# Altium schematic sheet Top.SchDoc
size B; SheetNumber: 1; SheetTotal: 4
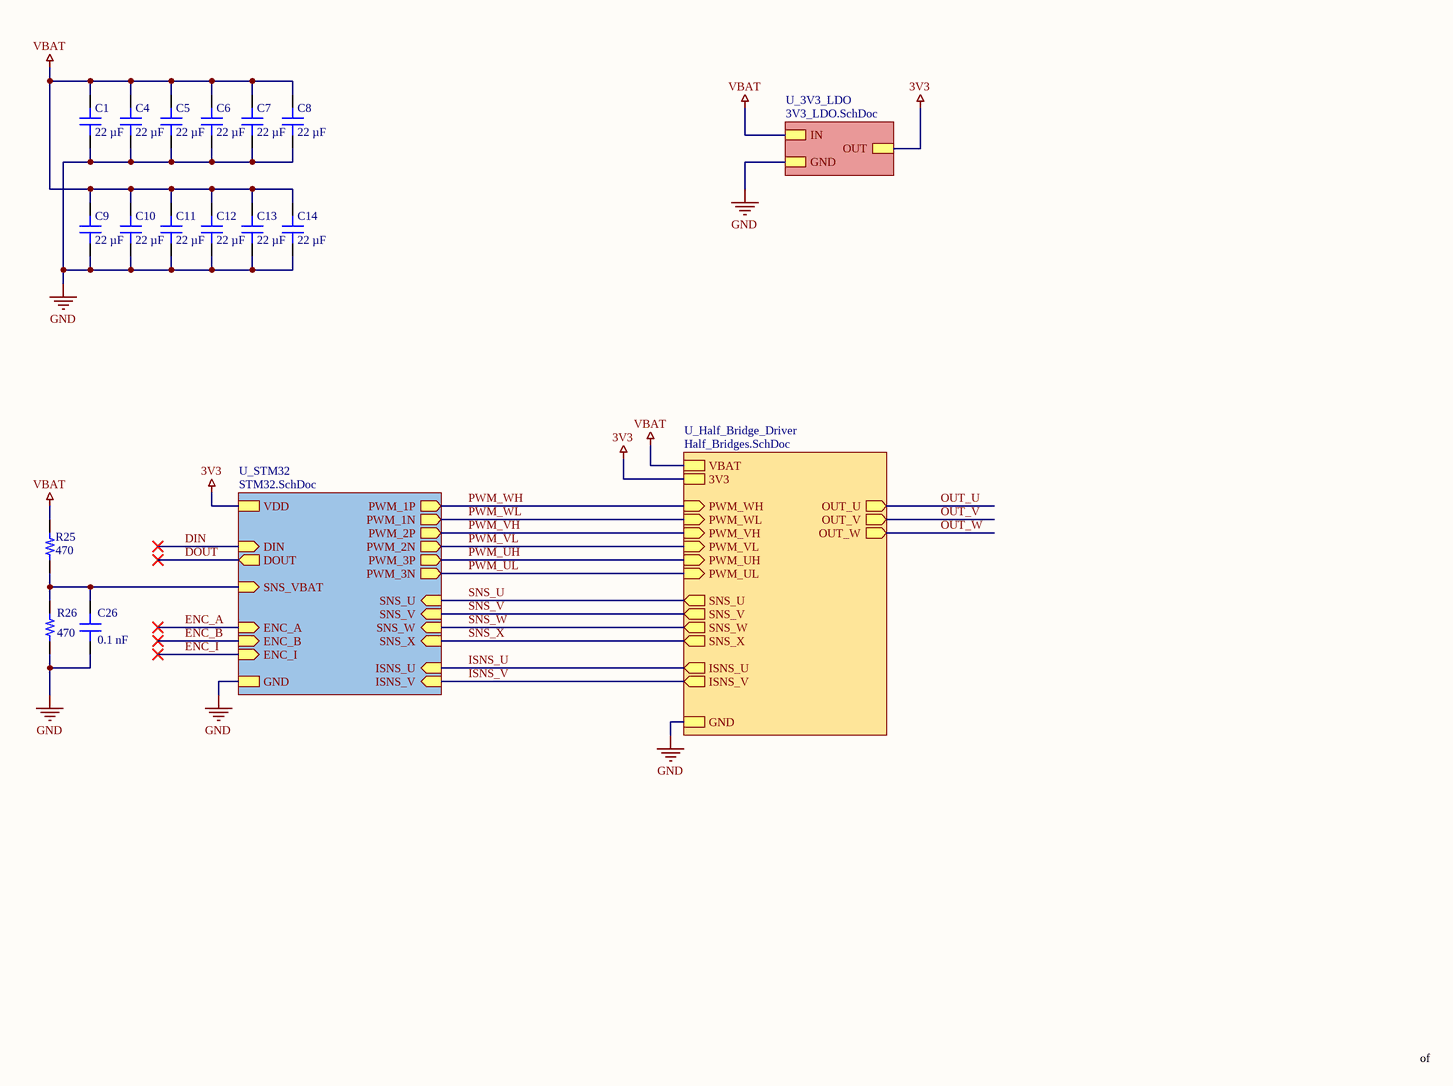
[diagram p0: Top.SchDoc]

## Parts
C1  22 µF  [CAP 0805_2012]
C4  22 µF  [CAP 0805_2012]
C5  22 µF  [CAP 0805_2012]
C6  22 µF  [CAP 0805_2012]
C7  22 µF  [CAP 0805_2012]
C8  22 µF  [CAP 0805_2012]
C9  22 µF  [CAP 0805_2012]
C10  22 µF  [CAP 0805_2012]
C11  22 µF  [CAP 0805_2012]
C12  22 µF  [CAP 0805_2012]
C13  22 µF  [CAP 0805_2012]
C14  22 µF  [CAP 0805_2012]
C26  0.1 nF  [CAP 0402_1005]
R25  470  [RES 0402_1005]
R26  470  [RES 0402_1005]

## Sub-sheets
U_3V3_LDO = 3V3_LDO.SchDoc: OUT, IN, GND
U_Half_Bridge_Driver = Half_Bridges.SchDoc: VBAT, GND, PWM_UH (in), PWM_UL (in), PWM_VH (in), PWM_VL (in), PWM_WH (in), PWM_WL (in), SNS_U (out), SNS_V (out), SNS_W (out), SNS_X (out), OUT_U (out), OUT_V (out), OUT_W (out), ISNS_U (out), ISNS_V (out), 3V3
U_STM32 = STM32.SchDoc: VDD, GND, PWM_2N (out), PWM_3N (out), PWM_1N (out), PWM_1P (out), PWM_2P (out), PWM_3P (out), ISNS_V (in), ISNS_U (in), SNS_X (in), SNS_W (in), SNS_V (in), SNS_U (in), ENC_A (in), ENC_B (in), ENC_I (in), DIN (in), DOUT (out), SNS_VBAT (in)

## Nets
3V3: sheet U_STM32/VDD, sheet U_Half_Bridge_Driver/3V3, sheet U_3V3_LDO/OUT
GND: C1.1 C4.1 C5.1 C6.1 C7.1 C8.1 C9.1 C10.1 C11.1 C12.1 C13.1 C14.1 C26.1 R26.1 ; sheet U_STM32/GND, sheet U_Half_Bridge_Driver/GND, sheet U_3V3_LDO/GND
VBAT: C1.2 C4.2 C5.2 C6.2 C7.2 C8.2 C9.2 C10.2 C11.2 C12.2 C13.2 C14.2 R25.2 ; sheet U_Half_Bridge_Driver/VBAT, sheet U_3V3_LDO/IN
DIN: sheet U_STM32/DIN
DOUT: sheet U_STM32/DOUT
ENC_A: sheet U_STM32/ENC_A
ENC_B: sheet U_STM32/ENC_B
ENC_I: sheet U_STM32/ENC_I
ISNS_U: sheet U_STM32/ISNS_U, sheet U_Half_Bridge_Driver/ISNS_U
ISNS_V: sheet U_STM32/ISNS_V, sheet U_Half_Bridge_Driver/ISNS_V
OUT_U: sheet U_Half_Bridge_Driver/OUT_U
OUT_V: sheet U_Half_Bridge_Driver/OUT_V
OUT_W: sheet U_Half_Bridge_Driver/OUT_W
PWM_UH: sheet U_STM32/PWM_3P, sheet U_Half_Bridge_Driver/PWM_UH
PWM_UL: sheet U_STM32/PWM_3N, sheet U_Half_Bridge_Driver/PWM_UL
PWM_VH: sheet U_STM32/PWM_2P, sheet U_Half_Bridge_Driver/PWM_VH
PWM_VL: sheet U_STM32/PWM_2N, sheet U_Half_Bridge_Driver/PWM_VL
PWM_WH: sheet U_STM32/PWM_1P, sheet U_Half_Bridge_Driver/PWM_WH
PWM_WL: sheet U_STM32/PWM_1N, sheet U_Half_Bridge_Driver/PWM_WL
SNS_U: sheet U_STM32/SNS_U, sheet U_Half_Bridge_Driver/SNS_U
SNS_V: sheet U_STM32/SNS_V, sheet U_Half_Bridge_Driver/SNS_V
SNS_W: sheet U_STM32/SNS_W, sheet U_Half_Bridge_Driver/SNS_W
SNS_X: sheet U_STM32/SNS_X, sheet U_Half_Bridge_Driver/SNS_X
NetC26_2: C26.2 R25.1 R26.2 ; sheet U_STM32/SNS_VBAT

## Notes on the sheet
- of

## Library data of the parts
C1 C4-C14 = CC0805MKX5R8BB226: CAP CER 22UF 25V X5R 0805; manufacturer: Yageo; Tolerance: ±20%; Part Number: CC0805MKX5R8BB226; Value: 22 µF; Applications: General Purpose; Capacitance: 22 µF; componentlink1description: Datasheet; componentlink1url: https://www.yageo.com/upload/media/product/productsearch/datasheet/mlcc/UPY-GPHC_X5R_4V-to-50V_25.pdf; componentlink2description: DigiKey Link; componentlink2url: https://www.digikey.com/en/products/detail/yageo/CC0805MKX5R8BB226/5195309; Device Package: 0805 (2012 Metric); lastupdated: 8/21/2022 8:03:23 PM; Lifecycle Status: Active; Minimum Order: 1; Mounting Type: Surface Mount, MLCC; Operating Temperature: -55°C ~ 85°C; Package / Case: 0805 (2012 Metric); packaging: TapeAndReel; partid: 39226; Part Status: Active; price: 0.10; series: CC; Size / Dimension: 0.079" L x 0.049" W (2.00mm x 1.25mm); Supplier 1: DigiKey; Supplier Part Number 1: 311-1903-1-ND; Temperature Coefficient: X5R; Thickness (Max): 0.057" (1.45mm); Voltage - Rated: 25V
C26 = C0402C104K4RACAUTO: CAP CER 0.1UF 16V X7R 0402; manufacturer: KEMET; Capacitance: 0.1 µF; Tolerance: ±10%; Part Number: C0402C104K4RACAUTO; Value: 0.1 nF; Applications: Automotive, Bypass, Decoupling; componentlink1description: Datasheet; componentlink1url: https://api.kemet.com/component-edge/download/specsheet/C0402C104K4RACAUTO.pdf; componentlink2description: DigiKey Link; componentlink2url: https://www.digikey.com/en/products/detail/kemet/C0402C104K4RACAUTO/3314827; Device Package: 0402 (1005 Metric); lastupdated: 8/14/2022 9:05:51 PM; Lifecycle Status: Active; Minimum Order: 1; Mounting Type: Surface Mount, MLCC; Operating Temperature: -55°C ~ 125°C; Package / Case: 0402 (1005 Metric); packaging: TapeAndReel; partid: 3024; Part Status: Active; price: 0.01; Ratings: AEC-Q200; series: SMD Auto X7R; Size / Dimension: 0.039" L x 0.020" W (1.00mm x 0.50mm); Supplier 1: DigiKey; Supplier Part Number 1: 399-6828-1-ND; Temperature Coefficient: X7R; Thickness (Max): 0.022" (0.55mm); Voltage - Rated: 16V
R25 R26 = RK73H1ETTP1432F: RES 14.3K OHM 1% 1/10W 0402; Manufacturer: KOA Speer Electronics, Inc.; Power (Watts): 0.1W, 1/10W; Resistance: 14.3 kOhms; Temperature Coefficient: ±100ppm/°C; Part Number: RK73H1ETTP1432F; Value: 470; ComponentLink1Description: Datasheet; ComponentLink1URL: http://www.koaspeer.com/catimages/Products/RK73H/RK73H.pdf; ComponentLink2Description: DigiKey Link; ComponentLink2URL: https://www.digikey.com/en/products/detail/koa-speer-electronics-inc/RK73H1ETTP1432F/9844351; Composition: Thick Film; Device Package: 0402 (1005 Metric); Features: Automotive AEC-Q200, Moisture Resistant; Height - Seated (Max): 0.016" (0.40mm); LastUpdated: 8/14/2022 9:23:49 PM; Lifecycle Status: Active; Minimum Order: 1; Number of Terminations: 2; Operating Temperature: -55°C ~ 155°C; Package / Case: 0402 (1005 Metric); Packaging: CutTape; PartId: 10193; Part Status: Active; Price: 0.01; Ratings: AEC-Q200; Series: RK73H; Size / Dimension: 0.039" L x 0.020" W (1.00mm x 0.50mm); Supplier 1: DigiKey; Supplier Part Number 1: 2019-RK73H1ETTP1432FCT-ND; Supplier Device Package: 0402; Tolerance: ±1%